# Altium schematic sheet Port_Connection_Rules.SchDoc
size A3
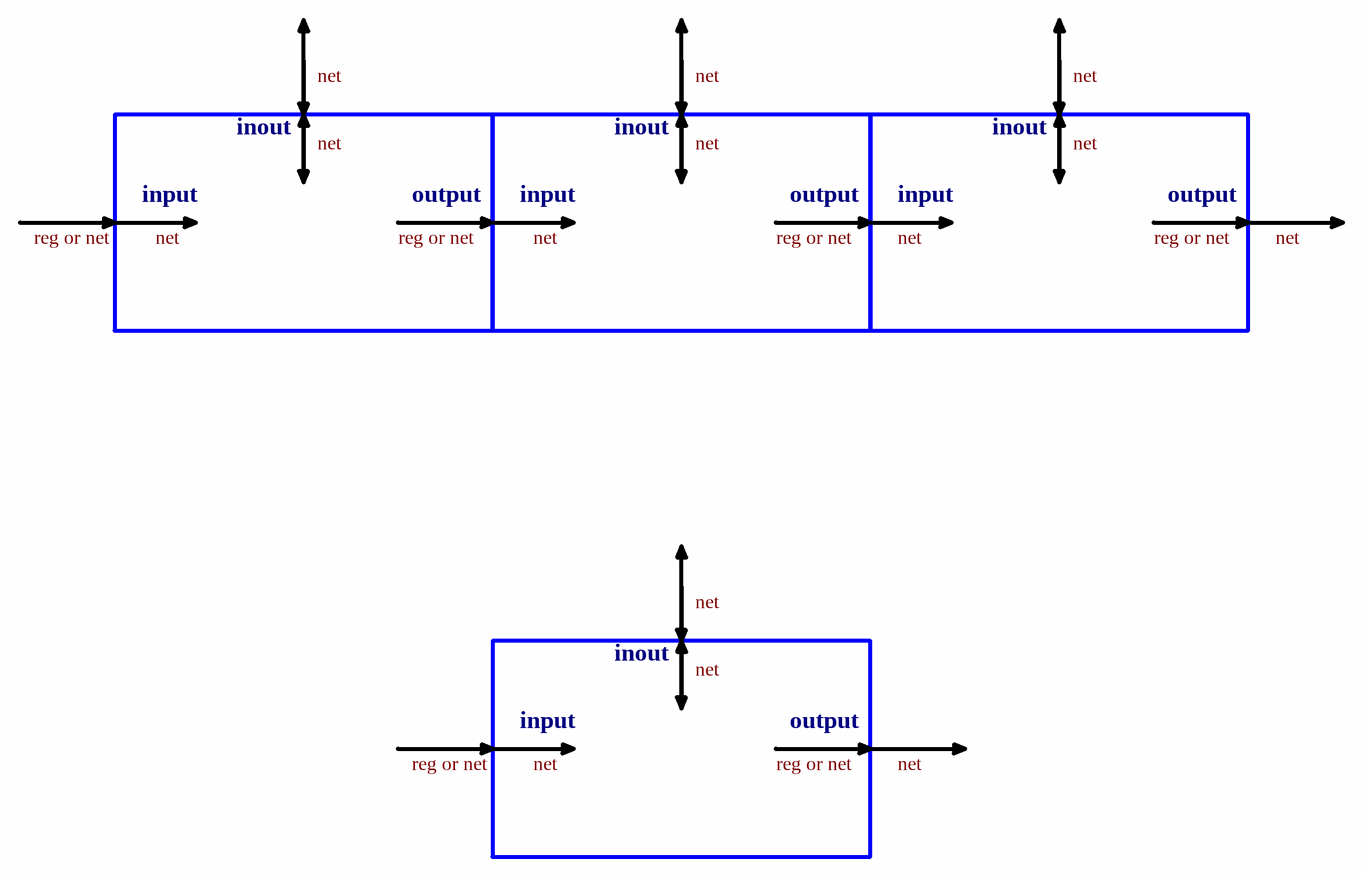
[diagram p0: Port_Connection_Rules.SchDoc]

## Notes on the sheet
- net
- inout
- input
- output
- reg or net